# Altium schematic sheet Interface.SchDoc
size 203 x 165 mm; SheetNumber: 4; SheetTotal: 6
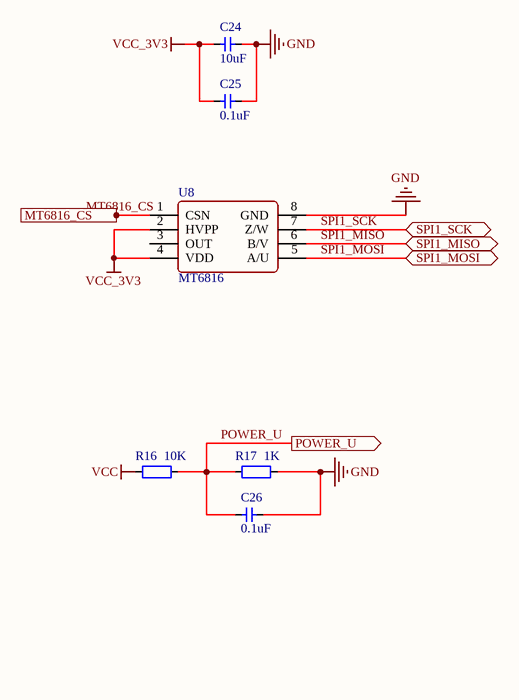
[diagram p0: Interface.SchDoc]

## Parts
C24  10uF  [CAP_0402]
C25  0.1uF  [CAP_0402]
C26  0.1uF  [CAP_0402]
R16  10K  [RES_0402]
R17  1K  [RES_0402]
U8  MT6816  [SO-8]

## Ports
MT6816_CS (in), POWER_U (out, see MCU[1A]), SPI1_MISO (bidir, see MCU[4A]), SPI1_MOSI (bidir, see MCU[4A]), SPI1_SCK (bidir, see MCU[4A])

## Nets
GND: C24.1 C25.1 C26.1 R17.2 U8.8(GND)
VCC: R16.1
VCC_3V3: C24.2 C25.2 U8.2(HVPP) U8.4(VDD)
MT6816_CS: U8.1(CSN) ; port MT6816_CS
POWER_U: C26.2 R16.2 R17.1 ; port POWER_U
SPI1_MISO: U8.6(B/V) ; port SPI1_MISO
SPI1_MOSI: U8.5(A/U) ; port SPI1_MOSI
SPI1_SCK: U8.7(Z/W) ; port SPI1_SCK

Not connected (* = marked no-connect by the designer): U8 3(OUT)

## Library data of the parts
C24-C26 = 电容-0402: Capacitor; Value: 0.1u
R16 R17 = 电阻-0402: Resistor; Value: 22R
U8 = MT6816: Magnetic Position Sensor